# EAGLE design hack (EAGLE 9.6.2)
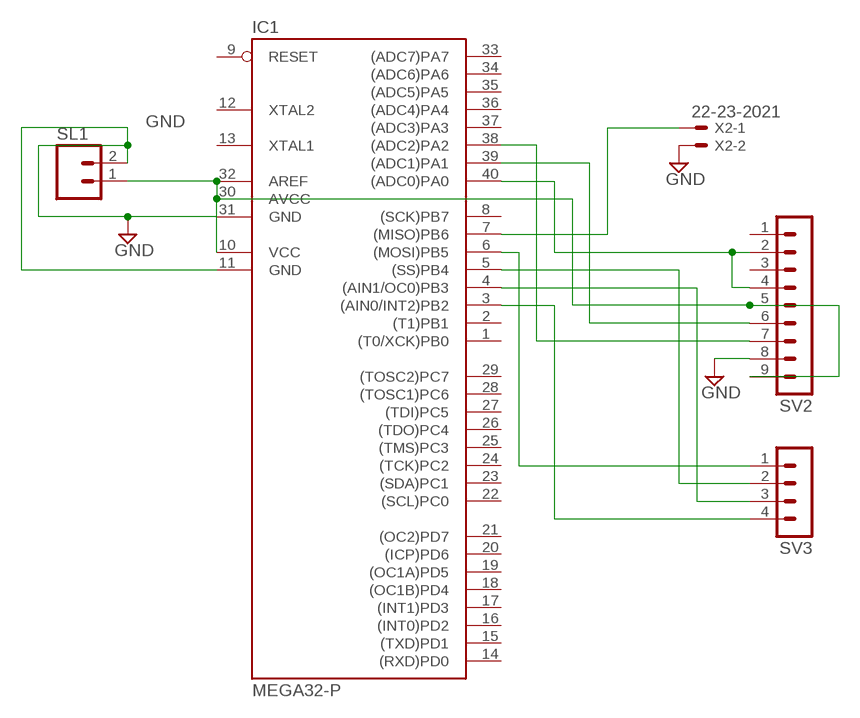
[diagram p0: schematic, sheet 1]

## Parts
IC1  MEGA32-P  [DIL40]
SL1  M02  [02P]
SV2  MA09-1W  [MA09-1W]
SV3  MA04-1  [MA04-1]
X2  22-23-2021  [22-23-2021]

## Nets
GND: IC1.11(GND) IC1.31(GND) SL1.2 SV2.8 X2.2
N$1: IC1.7((MISO)PB6) X2.1
N$2: IC1.6((MOSI)PB5) SV3.1
N$3: IC1.5((SS)PB4) SV3.2
N$4: IC1.40((ADC0)PA0) SV2.2 SV2.4
N$5: IC1.10(VCC) IC1.30(AVCC) IC1.32(AREF) SL1.1 SV2.5 SV2.9
N$6: IC1.39((ADC1)PA1) SV2.6
N$7: IC1.38((ADC2)PA2) SV2.7
N$8: IC1.4((AIN1/OC0)PB3) SV3.3
N$9: IC1.3((AIN0/INT2)PB2) SV3.4
Unconnected: IC1.1((T0/XCK)PB0) IC1.2((T1)PB1) IC1.8((SCK)PB7) IC1.9(RESET) IC1.12(XTAL2) IC1.13(XTAL1) IC1.14((RXD)PD0) IC1.15((TXD)PD1) IC1.16((INT0)PD2) IC1.17((INT1)PD3) IC1.18((OC1B)PD4) IC1.19((OC1A)PD5) IC1.20((ICP)PD6) IC1.21((OC2)PD7) IC1.22((SCL)PC0) IC1.23((SDA)PC1) IC1.24((TCK)PC2) IC1.25((TMS)PC3) IC1.26((TDO)PC4) IC1.27((TDI)PC5) IC1.28((TOSC1)PC6) IC1.29((TOSC2)PC7) IC1.33((ADC7)PA7) IC1.34((ADC6)PA6) IC1.35((ADC5)PA5) IC1.36((ADC4)PA4) IC1.37((ADC3)PA3) SV2.1 SV2.3

## Library data of the parts
IC1 = atmel:MEGA32-P: MICROCONTROLLER 32 Kbytes FLASH 2 Kbytes SRAM 1 Kbytes EEPROM USART 8-channel 10 bit ADC Source: www.atmel.com .. doc2503.pdf; MPN: ATMEGA32-16PU; OC_FARNELL: 1661729; OC_NEWARK: 51P1794
SL1 = con-amp-quick:M02: AMP QUICK CONNECTOR; OC_FARNELL: unknown; OC_NEWARK: unknown
SV2 = con-lstb:MA09-1W: PIN HEADER; OC_FARNELL: unknown; OC_NEWARK: unknown
SV3 = con-lstb:MA04-1: PIN HEADER; OC_FARNELL: unknown; OC_NEWARK: unknown
X2 = con-molex:22-23-2021: .100" (2.54mm) Center Header - 2 Pin; MF: MOLEX; MPN: 22-23-2021; OC_FARNELL: 1462926; OC_NEWARK: 25C3832

## Board
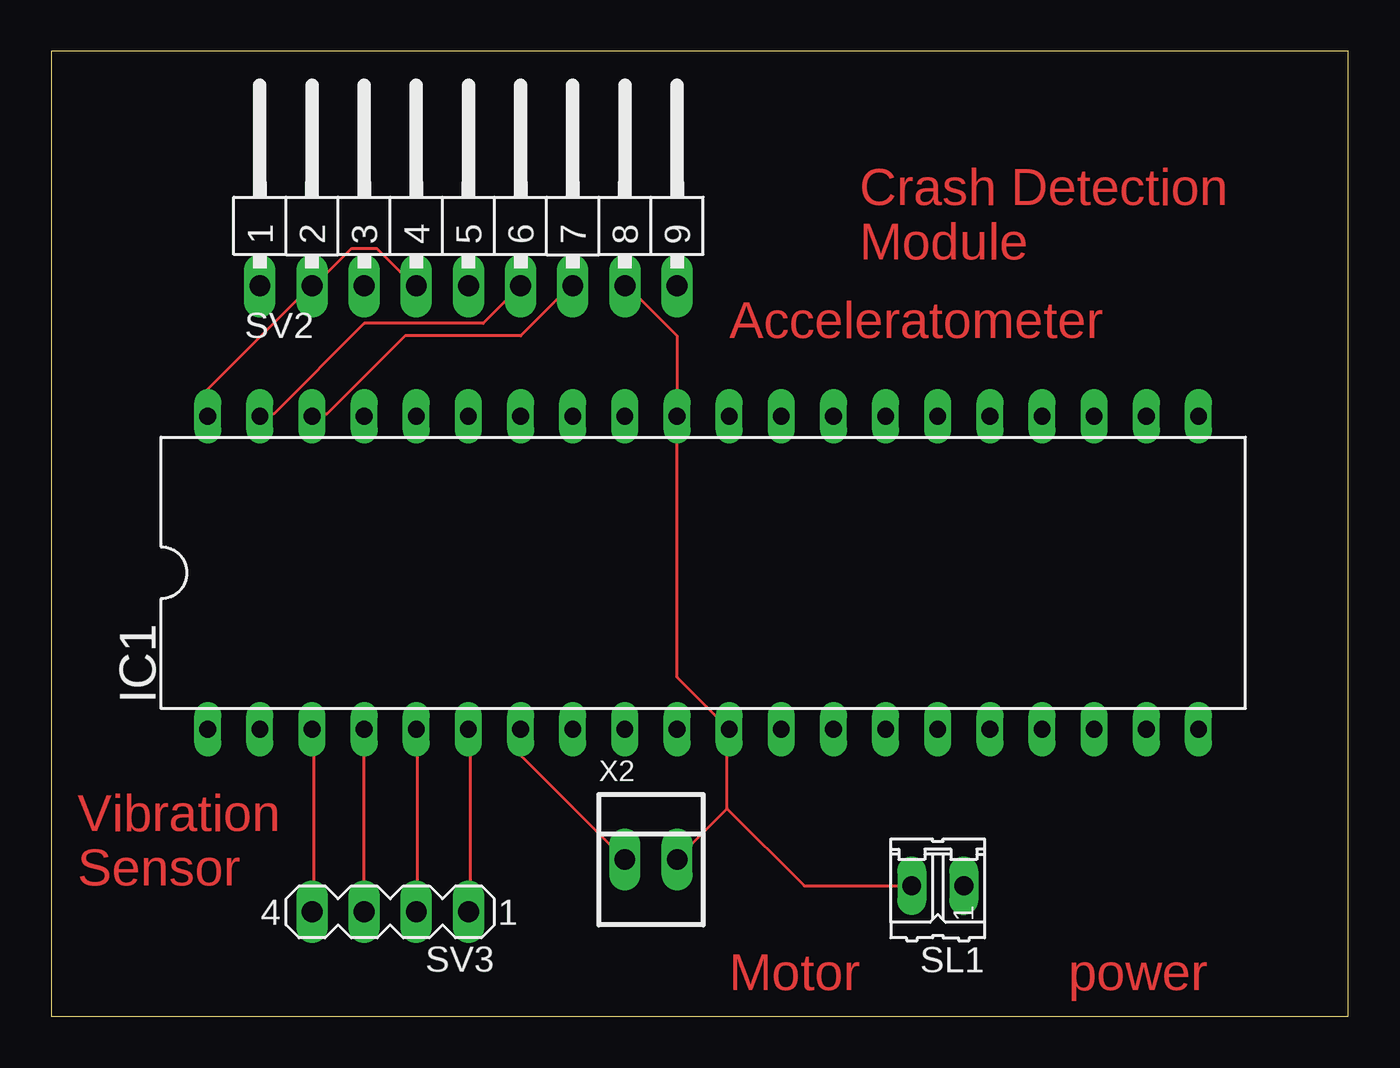
[diagram p1: board, top side]
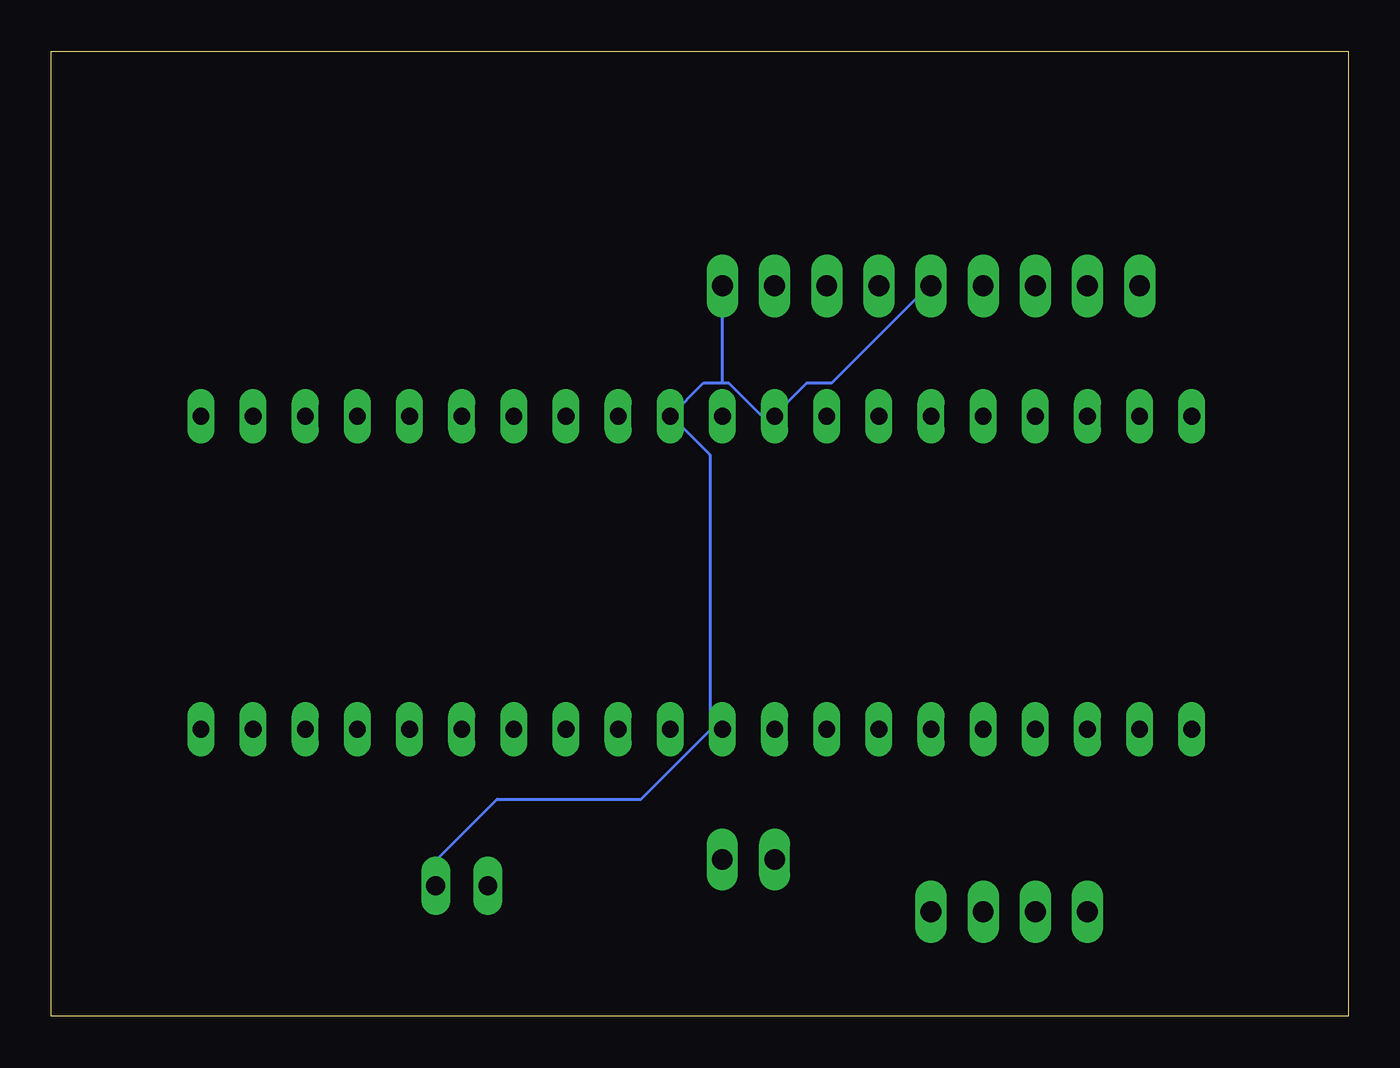
[diagram p2: board, bottom side, seen from below]

Size 63.17 x 46.98 mm. Coordinates in mm from the lower left corner, seen from the top.
Outline: 0,0 63.17,0 63.17,46.98 0,46.98 0,0
Copper layers (1*16): Top 0.035mm / dielectric 1.5mm / Bottom 0.035mm
Design rules "default": minimum track width 6mil, minimum drill 0.35mm, track to track 6mil, track to pad 6mil, pad to pad 6mil, via to via 6mil, smd to smd 6mil, copper to edge 40mil, drill to drill 6mil, minimum pad ring 10mil, minimum via ring 8mil, stop-mask expansion 4mil, vias tented up to drill 0mil, thermal gap 10mil

### Footprints (pad centres in the part's own frame; a part is rotated, then mirrored left to right if it is on the bottom)
DIL40 = drill 0.813 long: 1 -24.13,-7.62; 2 -21.59,-7.62; 3 -19.05,-7.62; 4 -16.51,-7.62; 5 -13.97,-7.62; 6 -11.43,-7.62; 7 -8.89,-7.62; 8 -6.35,-7.62; 9 -3.81,-7.62; 10 -1.27,-7.62; 11 1.27,-7.62; 12 3.81,-7.62; 13 6.35,-7.62; 14 8.89,-7.62; 15 11.43,-7.62; 16 13.97,-7.62; 17 16.51,-7.62; 18 19.05,-7.62; 19 21.59,-7.62; 20 24.13,-7.62; 21 24.13,7.62; 22 21.59,7.62; 23 19.05,7.62; 24 16.51,7.62; 25 13.97,7.62; 26 11.43,7.62; 27 8.89,7.62; 28 6.35,7.62; 29 3.81,7.62; 30 1.27,7.62; 31 -1.27,7.62; 32 -3.81,7.62; 33 -6.35,7.62; 34 -8.89,7.62; 35 -11.43,7.62; 36 -13.97,7.62; 37 -16.51,7.62; 38 -19.05,7.62; 39 -21.59,7.62; 40 -24.13,7.62
02P = drill 0.914 long: 1 -1.27,0; 2 1.27,0
MA09-1W = drill 1.016 long: 1 -10.16,0; 2 -7.62,0; 3 -5.08,0; 4 -2.54,0; 5 0,0; 6 2.54,0; 7 5.08,0; 8 7.62,0; 9 10.16,0
MA04-1 = drill 1.016 long: 1 -3.81,0; 2 -1.27,0; 3 1.27,0; 4 3.81,0
22-23-2021 = drill 1 long: 1 -1.27,0; 2 1.27,0

### Placement (x,y rotation side)
IC1  31.75,21.59 0 top
SL1  43.18,6.35 180 top
SV2  20.32,35.56 0 top
SV3  16.51,5.08 180 top
X2  29.21,7.62 0 top

### Tracks (layer width: path | path; a pad name or v marks a point on that pad's centre or on a via)
GND
  Top 0.152: SV2.8 28.04,35.56 30.48,33.12 IC1.31 30.48,16.51 IC1.11 32.92,13.92 32.92,10.11 | 32.92,10.11 30.48,7.67 X2.2 | SL1.2 36.68,6.35 32.92,10.11
N$1
  Top 0.152: IC1.7 22.86,12.7 X2.1
N$2
  Top 0.152: IC1.6 20.42,13.92 20.42,5.08 SV3.1
N$3
  Top 0.152: IC1.5 17.83,13.92 17.83,5.08 SV3.2
N$4
  Top 0.152: IC1.40 7.62,30.53 12.65,35.56 SV2.2 12.8,35.56 14.63,37.39 15.85,37.39 17.68,35.56 SV2.4
N$5
  Bottom 0.152: 31.09,13.92 30.48,13.92 IC1.10 31.09,13.92 | 31.09,13.92 34.44,10.57 41.45,10.57 44.45,7.57 SL1.1 | 30.48,30.84 31.39,30.84 IC1.30 32.92,29.16 31.09,27.33 31.09,13.92 | 30.48,30.84 30.17,30.84 28.65,29.31 28.04,29.31 IC1.32 27.89,29.31 26.36,30.84 25.15,30.84 20.42,35.56 SV2.5 | 30.48,30.84 SV2.9
N$6
  Top 0.152: SV2.6 21.03,33.73 15.24,33.73 10.82,29.31 10.21,29.31 IC1.39
N$7
  Top 0.152: IC1.38 12.8,29.31 13.41,29.31 17.22,33.12 22.86,33.12 25.3,35.56 SV2.7
N$8
  Top 0.152: SV3.3 IC1.4
N$9
  Top 0.152: IC1.3 12.8,13.92 12.8,5.08 SV3.4

### Text on the board
Top: Crash Detection / Module | Acceleratometer | Vibration / Sensor | Motor | power